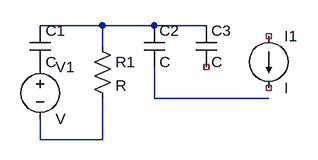
[diagram p0: schematic piccoliSegnali.asc]
piccoliSegnali.asc, the LTspice schematic file:
Version 4
SHEET 1 880 680
WIRE 96 64 0 64
WIRE 176 64 96 64
WIRE 256 64 176 64
WIRE 96 96 96 64
WIRE 176 176 176 128
WIRE 352 176 176 176
WIRE 0 240 0 208
WIRE 96 240 96 176
WIRE 96 240 0 240
SYMBOL voltage 0 112 R0
SYMATTR InstName V1
SYMBOL cap -16 64 R0
SYMATTR InstName C1
SYMBOL res 80 80 R0
SYMATTR InstName R1
SYMBOL cap 160 64 R0
SYMATTR InstName C2
SYMBOL current 352 80 R0
SYMATTR InstName I1
SYMBOL cap 240 64 R0
SYMATTR InstName C3

The netlist it stands for:
* piccoliSegnali.asc
V1 P001 N003 V
C1 N001 P001 C
R1 N001 N003 R
C2 N001 N002 C
I1 NC_01 NC_02 I
C3 N001 NC_03 C
.backanno
.end